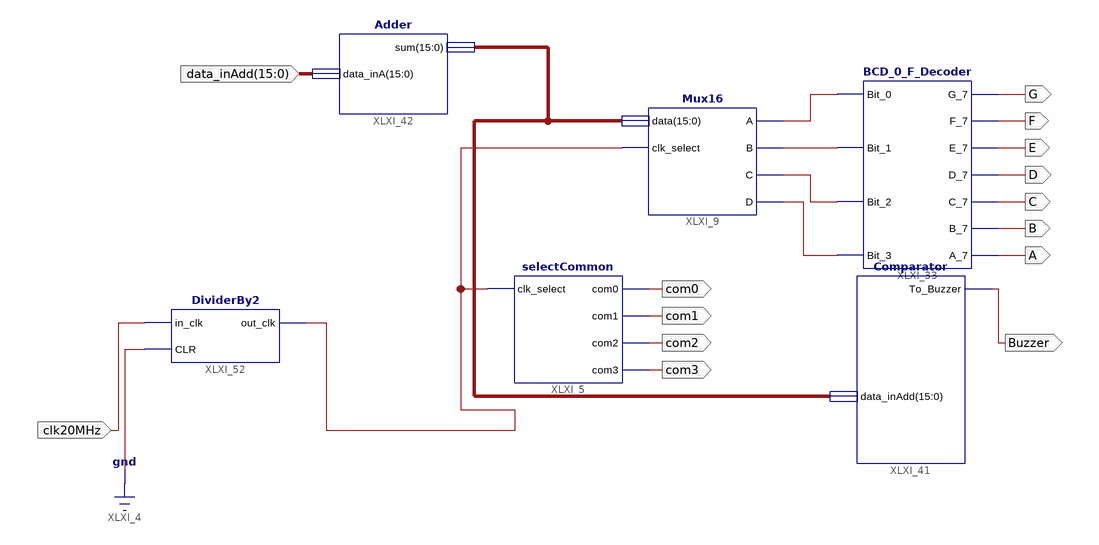
[diagram p0: schematic sheet 1]
// Xilinx ISE schematic adder_8bits.sch (spartan6) as structural Verilog: 6 symbols, 14 ports
module adder_8bits (
  input  [15:0] data_inAdd,
  input  clk20MHz,
  output com0,
  output com1,
  output com2,
  output com3,
  output G,
  output F,
  output E,
  output D,
  output C,
  output B,
  output A,
  output Buzzer
);

  wire XLXN_210, XLXN_211, XLXN_212, XLXN_213, XLXN_222;
  wire [15:0] XLXN_215;

  selectCommon XLXI_5 (.clk_select(XLXN_222), .com0(com0), .com1(com1), .com2(com2), .com3(com3));
  Mux16 XLXI_9 (.A(XLXN_210), .B(XLXN_211), .C(XLXN_212), .clk_select(XLXN_222), .D(XLXN_213), .data(XLXN_215));
  BCD_0_F_Decoder XLXI_33 (
    .Bit_0(XLXN_210), .Bit_1(XLXN_211), .Bit_2(XLXN_212), .Bit_3(XLXN_213), .G_7(G), .F_7(F), .E_7(E),
    .D_7(D), .C_7(C), .A_7(A), .B_7(B));
  Comparator XLXI_41 (.To_Buzzer(Buzzer), .data_inAdd(XLXN_215));
  Adder XLXI_42 (.data_inA(data_inAdd), .sum(XLXN_215));
  DividerBy2 XLXI_52 (.CLR(1'b0), .in_clk(clk20MHz), .out_clk(XLXN_222));
endmodule
